# Altium schematic sheet DualLink.SchDoc
size A4
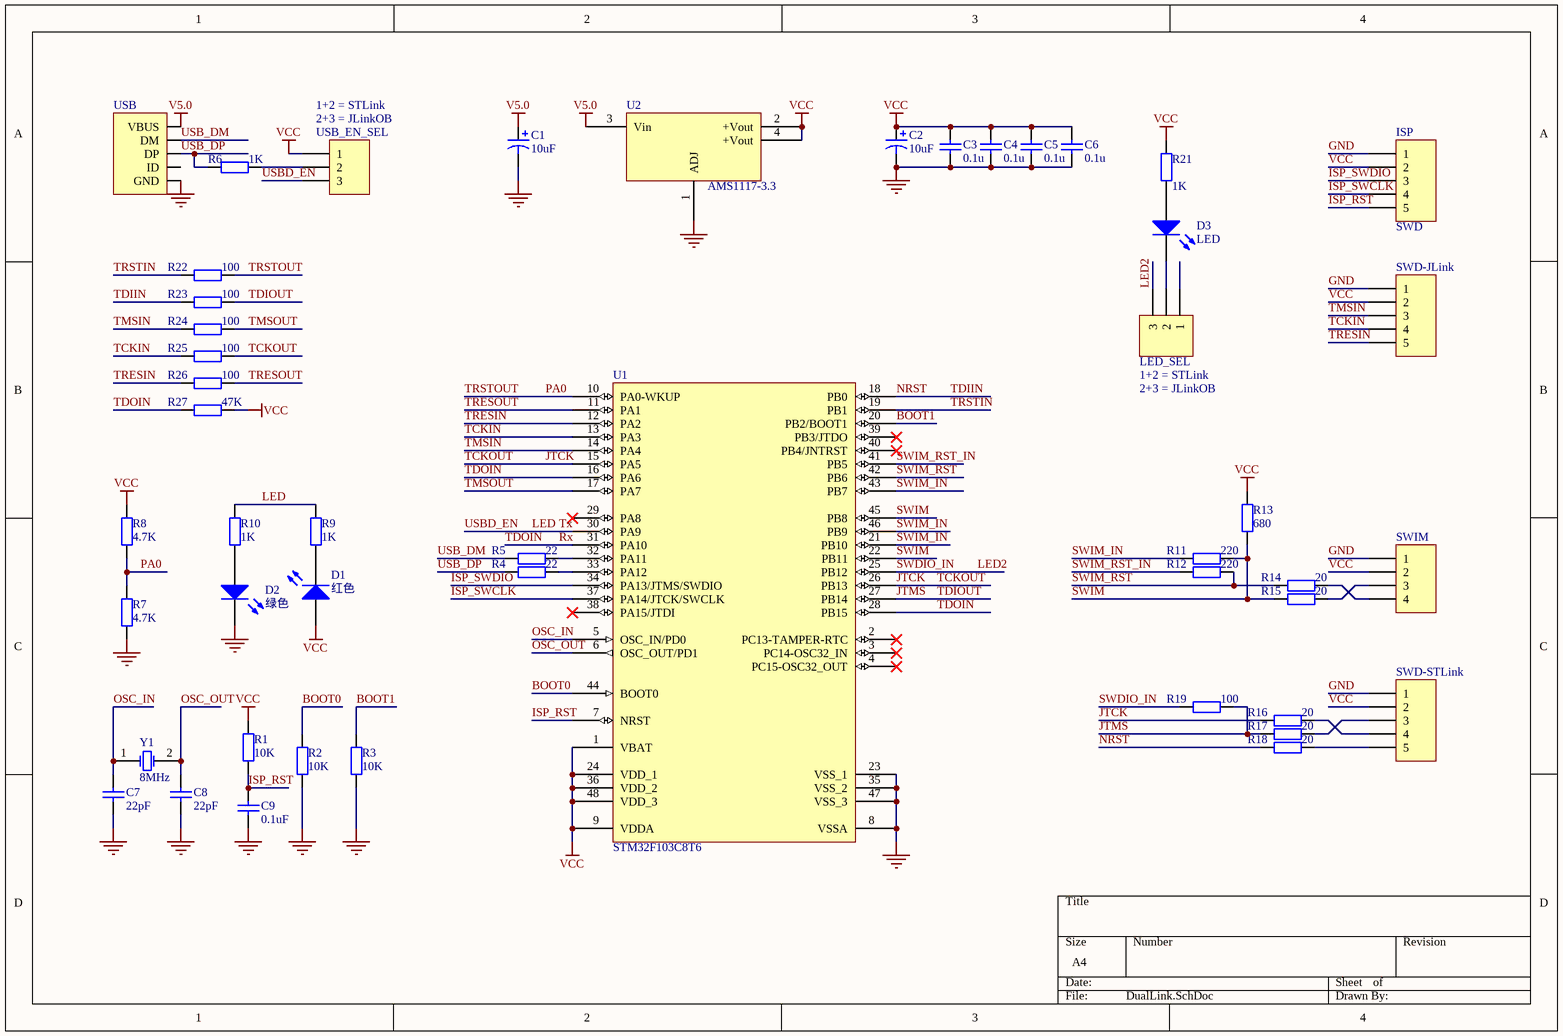
[diagram p0: DualLink.SchDoc]

## Parts
C1  value 10uF  [C1206A]
C2  value 10uF  [C1206A]
C3  value 0.1u  [C0603]
C4  value 0.1u  [C0603]
C5  value 0.1u  [C0603]
C6  value 0.1u  [C0603]
C7  value 22pF  [C0603]
C8  value 22pF  [C0603]
C9  value 0.1uF  [C0603]
D1  红色  [LED0603]
D2  绿色  [LED0603]
D3  LED  [LED0603]
ISP  SWD  [HDR1X5]
LED_SEL  (no value)  [HDR1X3]
R1  value 10K  [R0603]
R2  value 10K  [R0603]
R3  value 10K  [R0603]
R4  value 22  [R0603]
R5  value 22  [R0603]
R6  value 1K  [R0603]
R7  value 4.7K  [R0603]
R8  value 4.7K  [R0603]
R9  value 1K  [R0603]
R10  value 1K  [R0603]
R11  value 220  [R0603]
R12  value 220  [R0603]
R13  value 680  [R0603]
R14  value 20  [R0603]
R15  value 20  [R0603]
R16  value 20  [R0603]
R17  value 20  [R0603]
R18  value 20  [R0603]
R19  value 100  [R0603]
R21  value 1K  [R0603]
R22  value 100  [R0603]
R23  value 100  [R0603]
R24  value 100  [R0603]
R25  value 100  [R0603]
R26  value 100  [R0603]
R27  value 47K  [R0603]
SWD-JLink  SWD  [HDR1X5]  (value not drawn)
SWD-STLink  SWD  [HDR1X5]  (value not drawn)
SWIM  SWIM  [HDR1X4]  (value not drawn)
U1  STM32F103C8T6  [LQFP48_M]
U2  AMS1117-3.3  [SOT-223]
USB  USB_Micro  [USB_MICRO_B]  (value not drawn)
USB_EN_SEL  (no value)  [HDR1X3]
Y1  8MHz  [JZ]

## Nets
GND: C1.2 C2.2 C3.2 C4.2 C5.2 C6.2 C7.2 C8.2 C9.2 D2.2(K) ISP.1 R2.1 R3.1 R7.2 SWD-JLink.1 SWD-STLink.1 SWIM.1 U1.8(VSSA) U1.23(VSS_1) U1.35(VSS_2) U1.47(VSS_3) U2.1(ADJ) USB.5(GND)
V5.0: C1.1 U2.3(Vin) USB.1(VBUS)
VCC: C2.1 C3.1 C4.1 C5.1 C6.1 D1.1(A) ISP.2 R1.2 R8.1 R13.2 R21.1 R27.2 SWD-JLink.2 SWD-STLink.2 SWIM.2 U1.1(VBAT) U1.9(VDDA) U1.24(VDD_1) U1.36(VDD_2) U1.48(VDD_3) U2.2(+Vout) U2.4(+Vout) USB_EN_SEL.1
BOOT0: R2.2 U1.44(BOOT0)
BOOT1: R3.2 U1.20(PB2/BOOT1)
ISP_RST: C9.1 ISP.5 R1.1 U1.7(NRST)
ISP_SWCLK: ISP.4 U1.37(PA14/JTCK/SWCLK)
ISP_SWDIO: ISP.3 U1.34(PA13/JTMS/SWDIO)
JTCK: R16.2 R25.2 U1.15(PA5) U1.26(PB13)  [also labelled TCKOUT]
JTMS: R17.2 R19.1 R23.2 U1.27(PB14)  [also labelled TDIOUT]
LED: R9.1 R10.1 U1.30(PA9) USB_EN_SEL.3  [also labelled Tx, USBD_EN]
LED2: LED_SEL.3 R19.2 U1.25(PB12)  [also labelled SWDIO_IN]
NRST: R18.2 R23.1 U1.18(PB0)  [also labelled TDIIN]
OSC_IN: C7.1 U1.5(OSC_IN/PD0) Y1.1(OSC1)
OSC_OUT: C8.1 U1.6(OSC_OUT/PD1) Y1.2(OSC2)
PA0: R7.1 R8.2 R22.2 U1.10(PA0-WKUP)  [also labelled TRSTOUT]
Rx: R27.1 U1.16(PA6) U1.28(PB15) U1.31(PA10)  [also labelled TDOIN]
SWIM: R11.2 R13.1 R15.2 U1.22(PB11) U1.45(PB8)
SWIM_IN: R11.1 U1.21(PB10) U1.43(PB7) U1.46(PB9)
SWIM_RST: R12.2 R14.2 U1.42(PB6)
SWIM_RST_IN: R12.1 U1.41(PB5)
TCKIN: R25.1 SWD-JLink.4 U1.13(PA3)
TMSIN: R24.1 SWD-JLink.3 U1.14(PA4)
TMSOUT: R24.2 U1.17(PA7)
TRESIN: R26.1 SWD-JLink.5 U1.12(PA2)
TRESOUT: R26.2 U1.11(PA1)
TRSTIN: R22.1 U1.19(PB1)
USB_DM: R5.2 USB.2(DM)
USB_DP: R4.2 R6.1 USB.3(DP)
NetD1_2: D1.2(K) R9.2
NetD2_1: D2.1(A) R10.2
NetD3_1: D3.1(A) R21.2
NetD3_2: D3.2(K) LED_SEL.2
NetR4_1: R4.1 U1.33(PA12)
NetR5_1: R5.1 U1.32(PA11)
NetR6_2: R6.2 USB_EN_SEL.2
NetR14_1: R14.1 SWIM.4
NetR15_1: R15.1 SWIM.3
NetR16_1: R16.1 SWD-STLink.4
NetR17_1: R17.1 SWD-STLink.3
NetR18_1: R18.1 SWD-STLink.5

Not connected (* = marked no-connect by the designer): LED_SEL 1; U1 2(PC13-TAMPER-RTC)* 3(PC14-OSC32_IN)* 4(PC15-OSC32_OUT)* 29(PA8)* 38(PA15/JTDI)* 39(PB3/JTDO)* 40(PB4/JNTRST)*; USB 4(ID)

## Notes on the sheet
- (near USB_EN_SEL) 1+2 = STLink
- (near USB_EN_SEL) 2+3 = JLinkOB
- 1+2 = STLink
- 2+3 = JLinkOB

## Library data of the parts
C1 C2 = Cap Pol3: Polarized Capacitor (Surface Mount); Published: 8-Jun-2000; LatestRevisionDate: 29-May-2009; LatestRevisionNote: IPC-7351 Footprint Added.; PackageReference: C0805; Publisher: Altium Limited; PackageDescription: Chip Capacitor
C3-C9 = Cap: Capacitor; Published: 8-Jun-2000; LatestRevisionDate: 17-Jul-2002; LatestRevisionNote: Re-released for DXP Platform.; PackageReference: RAD-0.3; Publisher: Altium Limited
D1-D3 = LED2: Typical RED, GREEN, YELLOW, AMBER GaAs LED; Published: 8-Jun-2000; LatestRevisionDate: 17-Jul-2002; LatestRevisionNote: Re-released for DXP Platform.; PackageVersion: Feb-2002; PackageReference: 3.2X1.6X1.1; Publisher: Altium Limited
ISP SWD-JLink SWD-STLink = Header 5: Header, 5-Pin; LatestRevisionDate: 17-Jul-2002; LatestRevisionNote: Re-released for DXP Platform.; Publisher: Altium Limited
LED_SEL USB_EN_SEL = Header 3: Header, 3-Pin; LatestRevisionDate: 17-Jul-2002; LatestRevisionNote: Re-released for DXP Platform.; Publisher: Altium Limited
R1-R19 R21-R27 = Res2: Resistor; Published: 8-Jun-2000; LatestRevisionDate: 17-Jul-2002; LatestRevisionNote: Re-released for DXP Platform.; PackageReference: AXIAL-0.4; Publisher: Altium Limited
SWIM = Header 4: Header, 4-Pin; LatestRevisionDate: 17-Jul-2002; LatestRevisionNote: Re-released for DXP Platform.; Publisher: Altium Limited
U1 = STM32F103C8T6: STM32 ARM-based 32-bit MCU with 64 Kbytes Flash, 48-pin LQFP, Industrial Temperature; Published: 30-May-2008; DatasheetVersion: rev6, Mar-2008; PackageVersion: Mar-2008; PackageReference: LQFP48; Publisher: Altium Limited; PackageDescription: 48-Pin Low-Profile Quad Flat Pack, 7 x 7 mm Body, 0.5 mm Pitch (LQFP48); ComponentLink1Description: Manufacturer Link; ComponentLink1URL: www.st.com/stm32; ComponentLink2Description: Datasheet; ComponentLink2URL: http://www.st.com/stonline/products/literature/ds/13587.pdf
U2 = TL783C
USB = USB_Micro: USB
Y1 = XTAL: Crystal Oscillator; Published: 8-Jun-2000; LatestRevisionDate: 17-Jul-2002; LatestRevisionNote: Re-released for DXP Platform.; PackageReference: R38; Publisher: Altium Limited